# EAGLE design xclock_B (EAGLE 7.7.0)
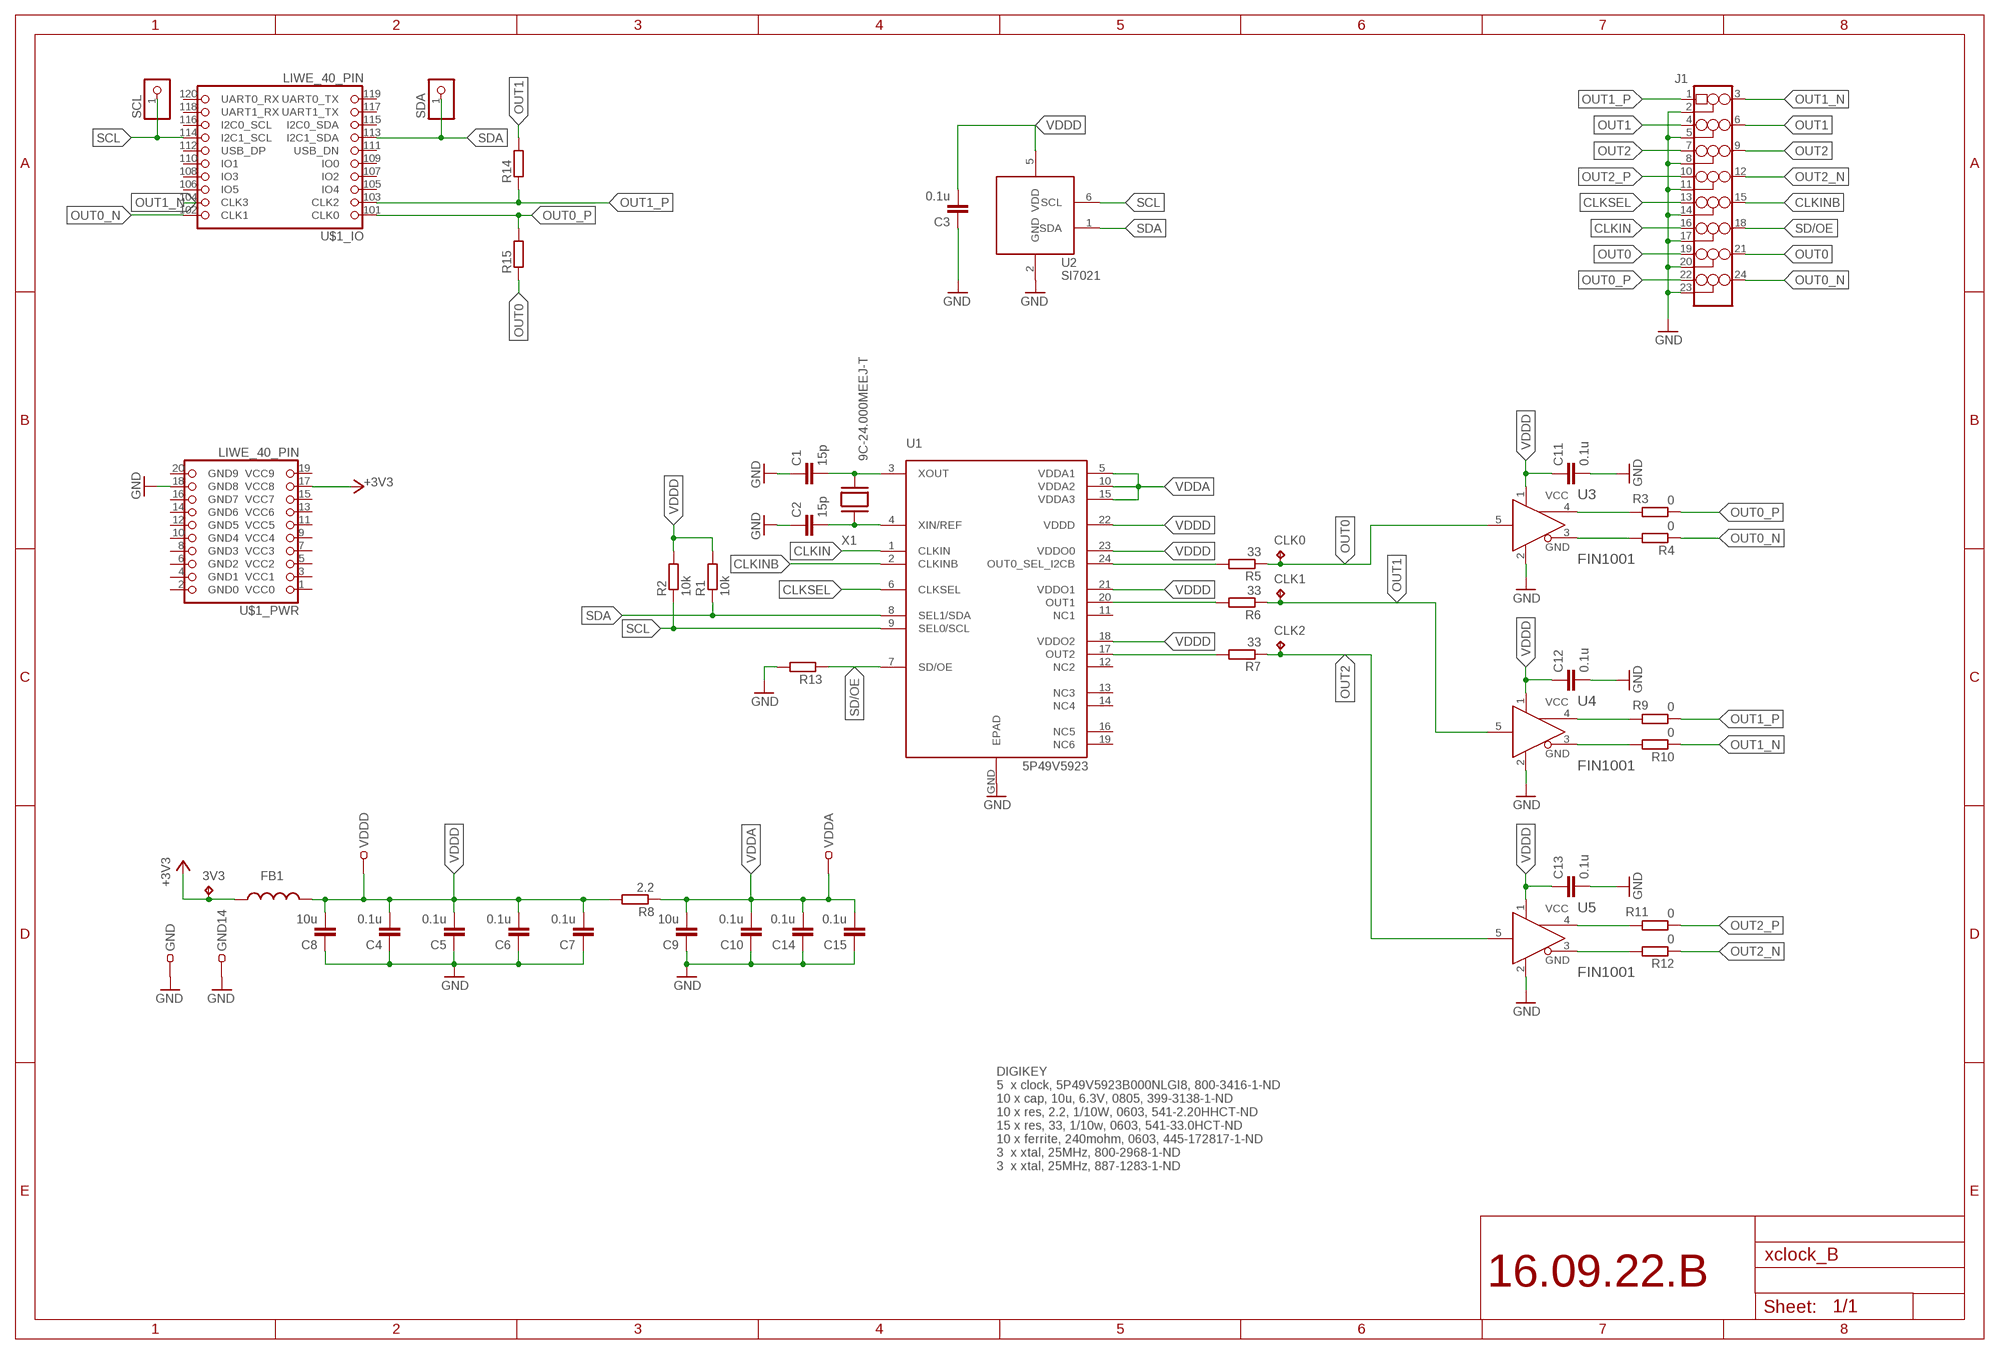
[diagram p0: schematic, sheet 1]

## Parts
3V3  TPB1,27  [B1,27]
C1  15p  C-EUC0603  [C0603]
C2  15p  C-EUC0603  [C0603]
C3  0.1u  C-EUC0603  [C0603]
C4  0.1u  C-EUC0603  [C0603]
C5  0.1u  C-EUC0603  [C0603]
C6  0.1u  C-EUC0603  [C0603]
C7  0.1u  C-EUC0603  [C0603]
C8  10u  C-EUC0805  [C0805]
C9  10u  C-EUC0805  [C0805]
C10  0.1u  C-EUC0603  [C0603]
C11  0.1u  C-EUC0603  [C0603]
C12  0.1u  C-EUC0603  [C0603]
C13  0.1u  C-EUC0603  [C0603]
C14  0.1u  C-EUC0603  [C0603]
C15  0.1u  C-EUC0603  [C0603]
CLK0  TPB1,27  [B1,27]
CLK1  TPB1,27  [B1,27]
CLK2  TPB1,27  [B1,27]
FB1  L0603(1608)  [L0603]
GND  TEST-22-MULTICOMP  [TEST_1MM]
GND14  TEST-22-MULTICOMP  [TEST_1MM]
J1  PINHD-3X8/90  [3X08/90]
R1  10k  R-EU_R0603  [R0603]
R2  10k  R-EU_R0603  [R0603]
R3  0  R-EU_R0603  [R0603]
R4  0  R-EU_R0603  [R0603]
R5  33  R-EU_R0603  [R0603]
R6  33  R-EU_R0603  [R0603]
R7  33  R-EU_R0603  [R0603]
R8  2.2  R-EU_R0603  [R0603]
R9  0  R-EU_R0603  [R0603]
R10  0  R-EU_R0603  [R0603]
R11  0  R-EU_R0603  [R0603]
R12  0  R-EU_R0603  [R0603]
R13  R-EU_R0603  [R0603]
R14  R-EU_R0603  [R0603]
R15  R-EU_R0603  [R0603]
SCL  PINHD-1X1  [1X01]
SDA  PINHD-1X1  [1X01]
U1  5P49V5923  [VFQFPN_24_4X4]
U2  SI7021  [SI7021]
U3  FIN1001  [SOT95P280X140-5N]
U4  FIN1001  [SOT95P280X140-5N]
U5  FIN1001  [SOT95P280X140-5N]
U$1  LIWE_40_PIN  [LIWE_40_PIN_8X8]
VDDA  TEST-22-MULTICOMP  [TEST_1MM]
VDDD  TEST-22-MULTICOMP  [TEST_1MM]
X1  9C-24.000MEEJ-T  TXC_9C  [TXC_SMD_HC-49S]

## Nets
+3V3: 3V3.TP FB1.1 U$1.17(_PWR:VCC8)
CLKIN: J1.16 U1.1(CLKIN)
CLKINB: J1.15 U1.2(CLKINB)
CLKSEL: J1.13 U1.6(CLKSEL)
GND: C1.1 C2.1 C3.1 C4.1 C5.1 C6.1 C7.1 C8.1 C9.1 C10.1 C11.2 C12.2 C13.2 C14.1 C15.1 GND14.1 GND.1 J1.2 J1.5 J1.8 J1.11 J1.14 J1.17 J1.20 J1.23 R13.2 U1.GND(EPAD) U2.2(GND) U3.2(GND) U4.2(GND) U5.2(GND) U$1.18(_PWR:GND8)
OUT0: CLK0.TP J1.19 J1.21 R5.1 R15.1 U3.5(RIN)
OUT0_: R5.2 U1.24(OUT0_SEL_I2CB)
OUT0_N: J1.24 R4.1 U$1.102(_IO:CLK1)
OUT0_N_: R4.2 U3.3(ROUT-)
OUT0_P: J1.22 R3.1 R15.2 U$1.101(_IO:CLK0)
OUT0_P_: R3.2 U3.4(ROUT+)
OUT1: CLK1.TP J1.4 J1.6 R6.1 R14.2 U4.5(RIN)
OUT1_: R6.2 U1.20(OUT1)
OUT1_N: J1.3 R10.1 U$1.104(_IO:CLK3)
OUT1_N_: R10.2 U4.3(ROUT-)
OUT1_P: J1.1 R9.1 R14.1 U$1.103(_IO:CLK2)
OUT1_P_: R9.2 U4.4(ROUT+)
OUT2: CLK2.TP J1.7 J1.9 R7.1 U5.5(RIN)
OUT2_: R7.2 U1.17(OUT2)
OUT2_N: J1.12 R12.1
OUT2_N_: R12.2 U5.3(ROUT-)
OUT2_P: J1.10 R11.1
OUT2_P_: R11.2 U5.4(ROUT+)
SCL: R2.1 SCL.1 U1.9(SEL0/SCL) U2.6(SCL) U$1.114(_IO:I2C1_SCL)
SD/OE: J1.18 R13.1 U1.7(SD/OE)
SDA: R1.1 SDA.1 U1.8(SEL1/SDA) U2.1(SDA) U$1.113(_IO:I2C1_SDA)
VDDA: C9.2 C10.2 C14.2 C15.2 R8.1 U1.5(VDDA1) U1.10(VDDA2) U1.15(VDDA3) VDDA.1
VDDD: C3.2 C4.2 C5.2 C6.2 C7.2 C8.2 C11.1 C12.1 C13.1 FB1.2 R1.2 R2.2 R8.2 U1.18(VDDO2) U1.21(VDDO1) U1.22(VDDD) U1.23(VDDO0) U2.5(VDD) U3.1(VCC) U4.1(VCC) U5.1(VCC) VDDD.1
XIN: C2.2 U1.4(XIN/REF) X1.1
XOUT: C1.2 U1.3(XOUT) X1.2
Unconnected: U1.11(NC1) U1.12(NC2) U1.13(NC3) U1.14(NC4) U1.16(NC5) U1.19(NC6) U$1.1(_PWR:VCC0) U$1.2(_PWR:GND0) U$1.3(_PWR:VCC1) U$1.4(_PWR:GND1) U$1.5(_PWR:VCC2) U$1.6(_PWR:GND2) U$1.7(_PWR:VCC3) U$1.8(_PWR:GND3) U$1.9(_PWR:VCC4) U$1.10(_PWR:GND4) U$1.11(_PWR:VCC5) U$1.12(_PWR:GND5) U$1.13(_PWR:VCC6) U$1.14(_PWR:GND6) U$1.15(_PWR:VCC7) U$1.16(_PWR:GND7) U$1.19(_PWR:VCC9) U$1.20(_PWR:GND9) U$1.105(_IO:IO4) U$1.106(_IO:IO5) U$1.107(_IO:IO2) U$1.108(_IO:IO3) U$1.109(_IO:IO0) U$1.110(_IO:IO1) U$1.111(_IO:USB_DN) U$1.112(_IO:USB_DP) U$1.115(_IO:I2C0_SDA) U$1.116(_IO:I2C0_SCL) U$1.117(_IO:UART1_TX) U$1.118(_IO:UART1_RX) U$1.119(_IO:UART0_TX) U$1.120(_IO:UART0_RX)

## Notes on the sheet
- DIGIKEY
  5  x clock, 5P49V5923B000NLGI8, 800-3416-1-ND
  10 x cap, 10u, 6.3V, 0805, 399-3138-1-ND
  10 x res, 2.2, 1/10W, 0603, 541-2.20HHCT-ND
  15 x res, 33, 1/10w, 0603, 541-33.0HCT-ND
  10 x ferrite, 240mohm, 0603, 445-172817-1-ND
  3  x xtal, 25MHz, 800-2968-1-ND
  3  x xtal, 25MHz, 887-1283-1-ND
- 16.09.22.B

## Library data of the parts
3V3 CLK0 CLK1 CLK2 = testpad:TP: Test pad
C1-C15 = rcl:C-EU: CAPACITOR, European symbol
FB1 = 25cmsquare:L
GND GND14 VDDA VDDD = 25cmsquare:TEST-22-MULTICOMP: MULTICOMP TEST-22 TEST PIN, PCB, 1.0MM FARNELL: 1702010
J1 = 25pinhead:PINHD-3X8
R1-R15 = rcl:R-EU_: RESISTOR, European symbol
SCL SDA = 25pinhead:PINHD-1X1: PIN HEADER
U1 = 25cmsquare:5P49V5923
U2 = 25cmsquare:SI7021: SI7021 https://www.silabs.com/Support%20Documents/TechnicalDocs/Si7021-A20.pdf
U3-U5 = 25cmsquare:FIN1001
U$1 = 25cmsquare:LIWE_40_PIN
X1 = 25cmsquare:TXC_9C

## Board
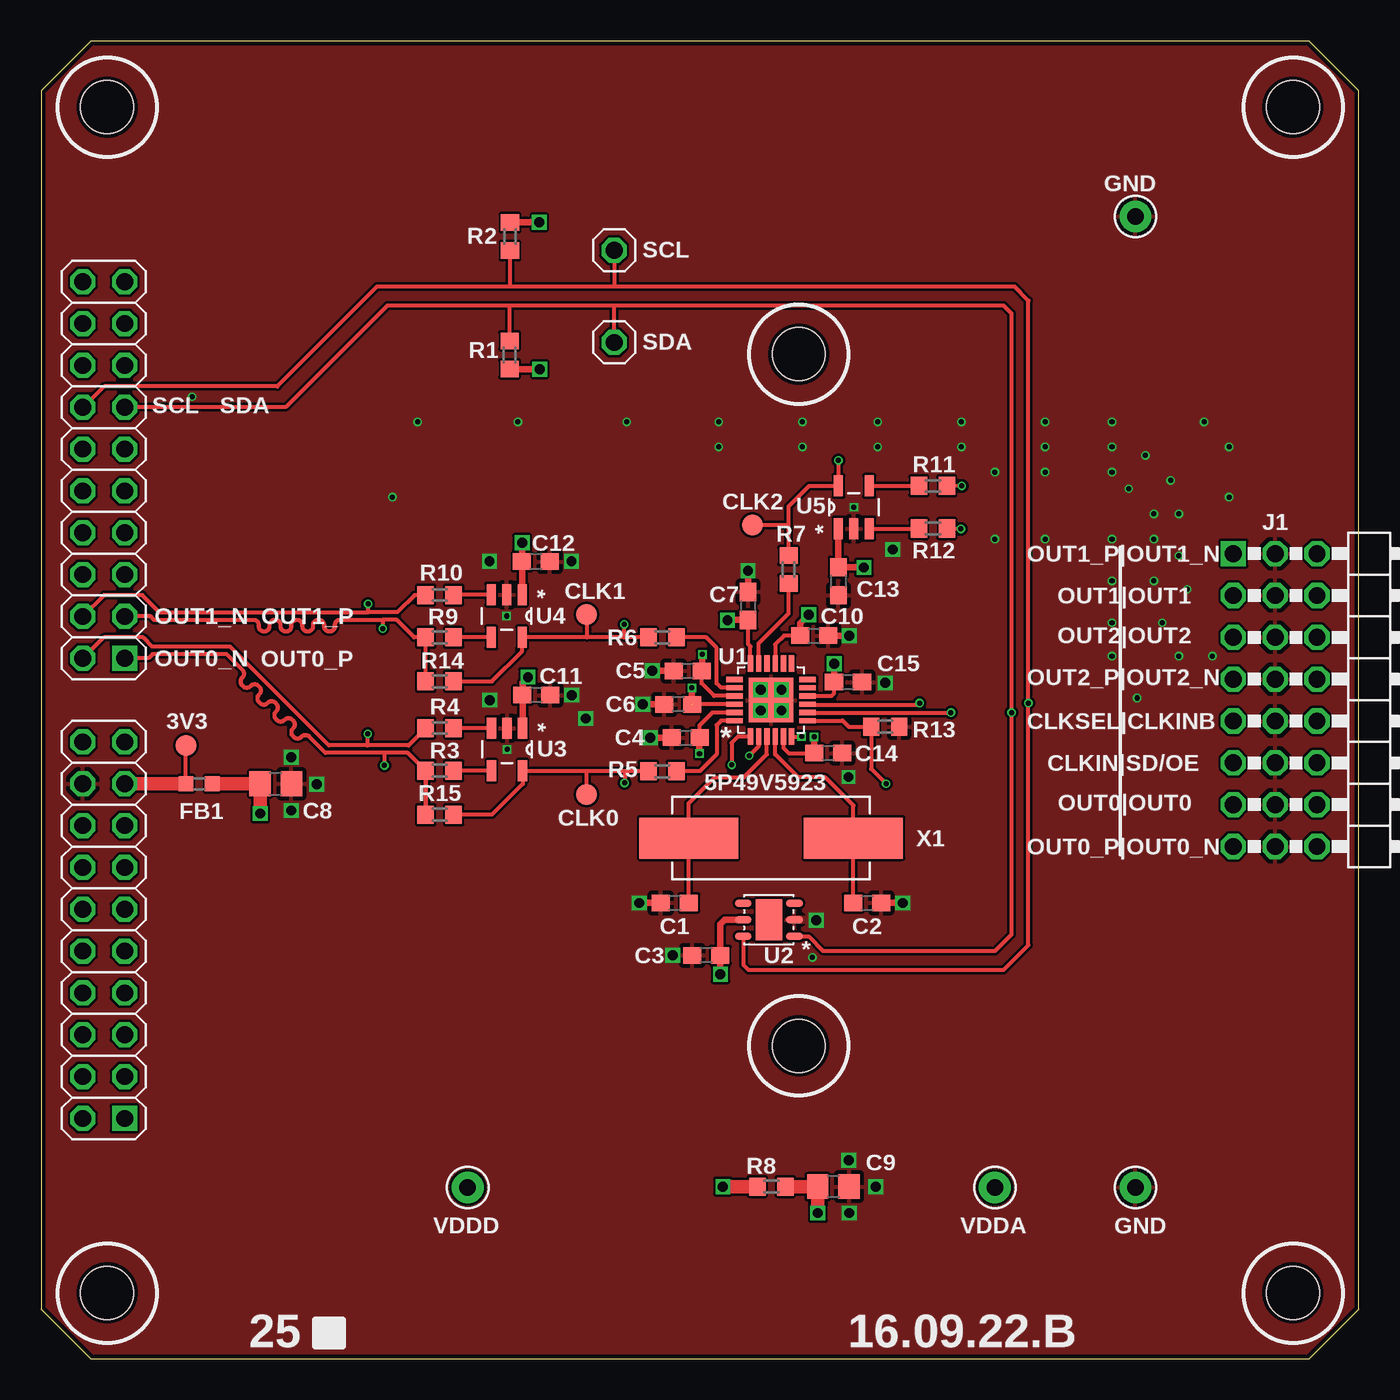
[diagram p1: board, top side]
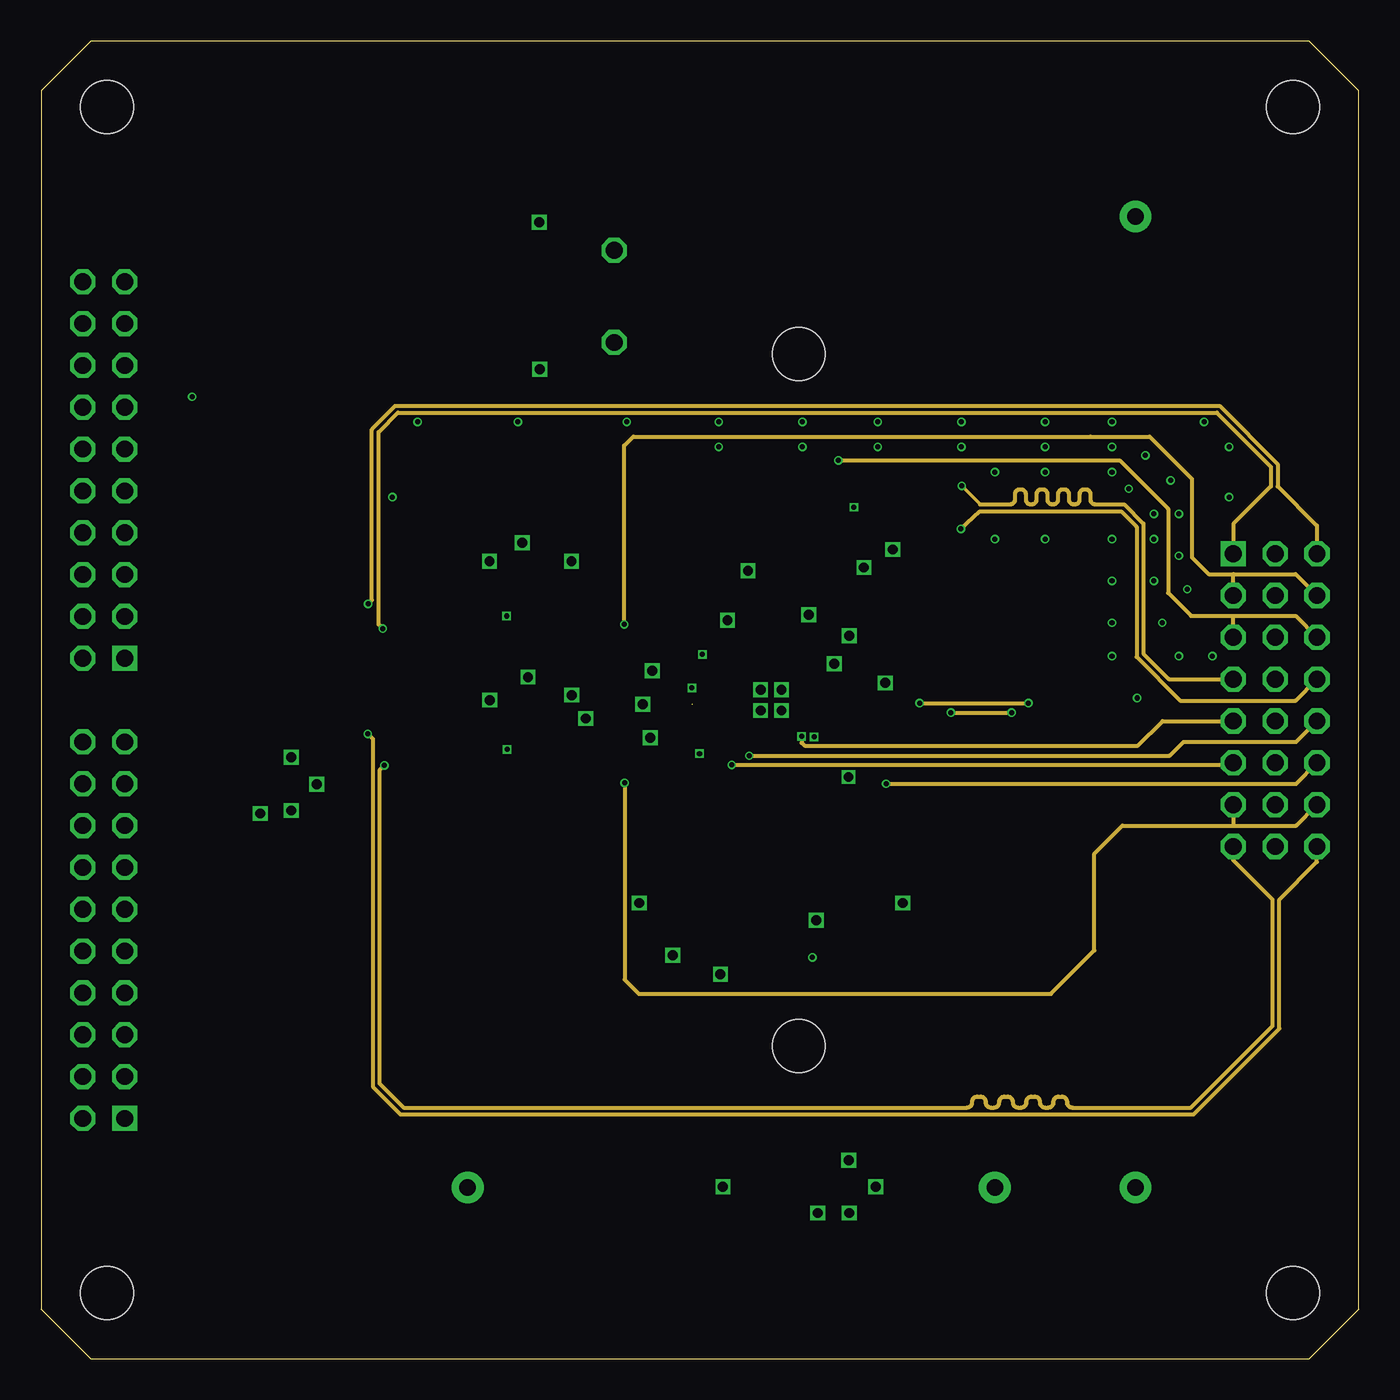
[diagram p2: board, inner layer Route2]
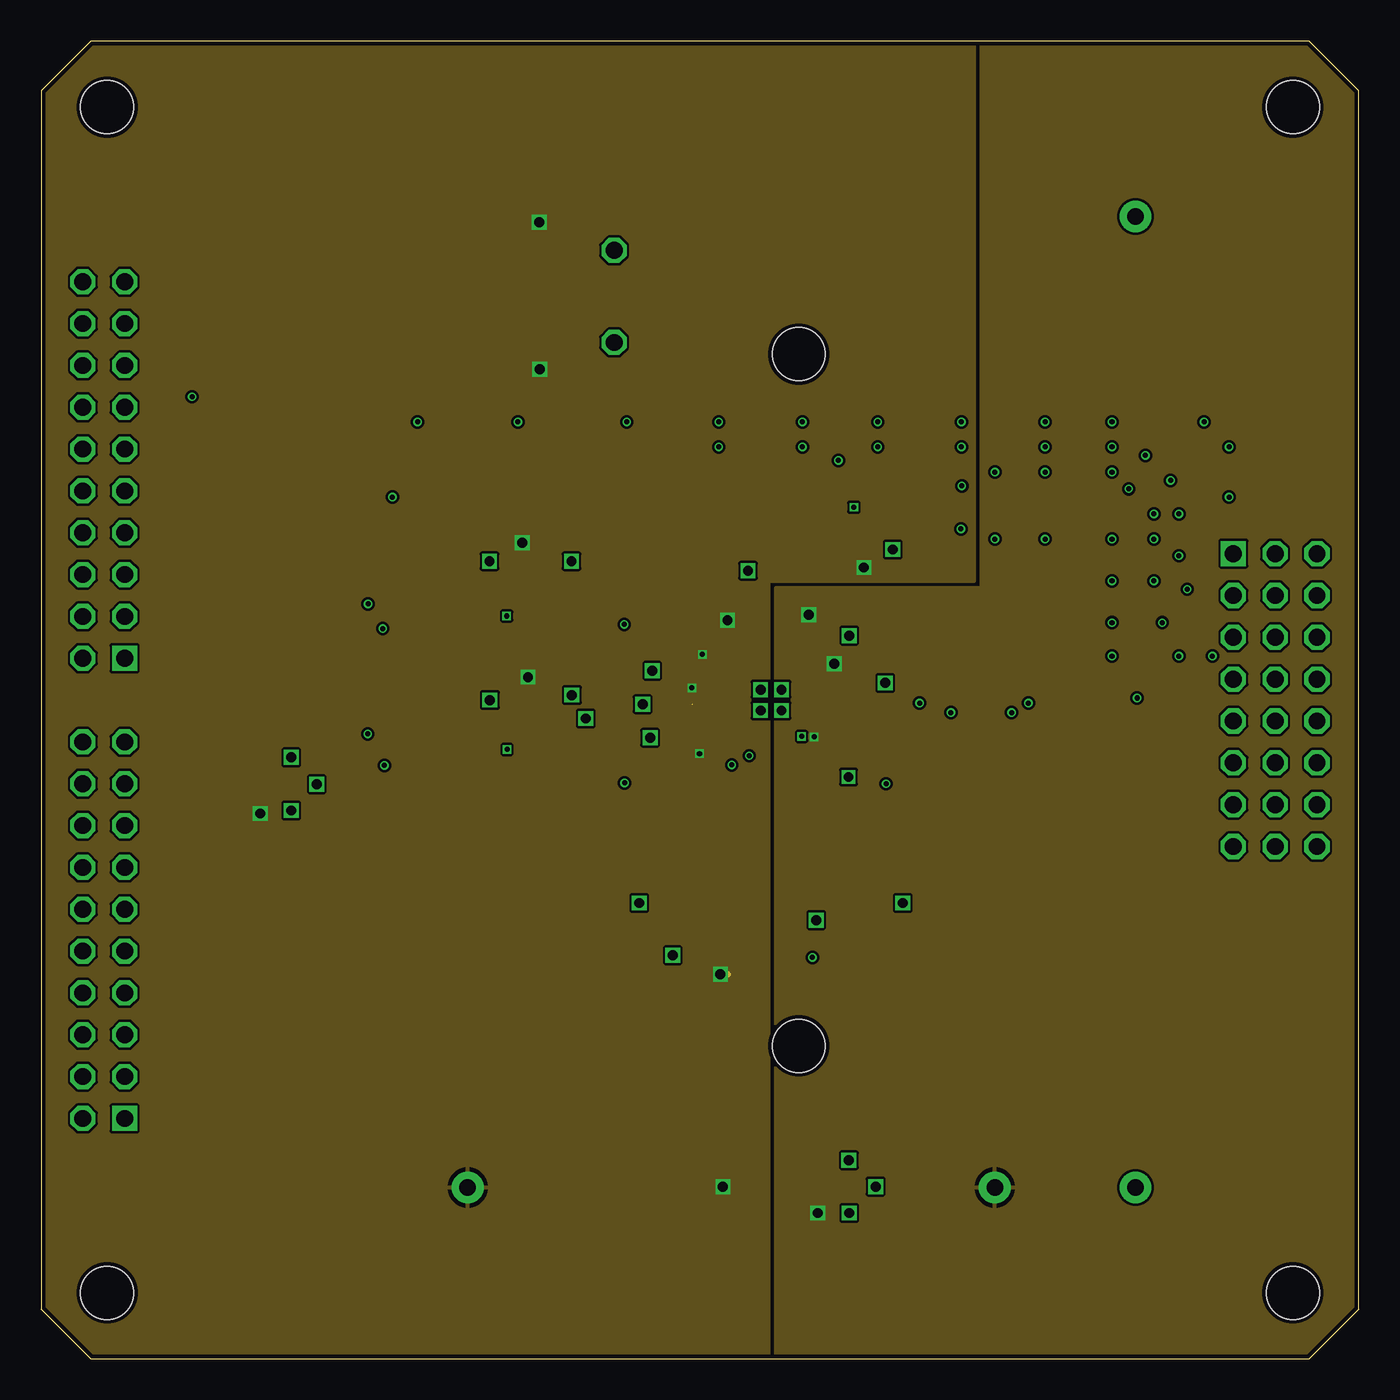
[diagram p3: board, inner layer Route15]
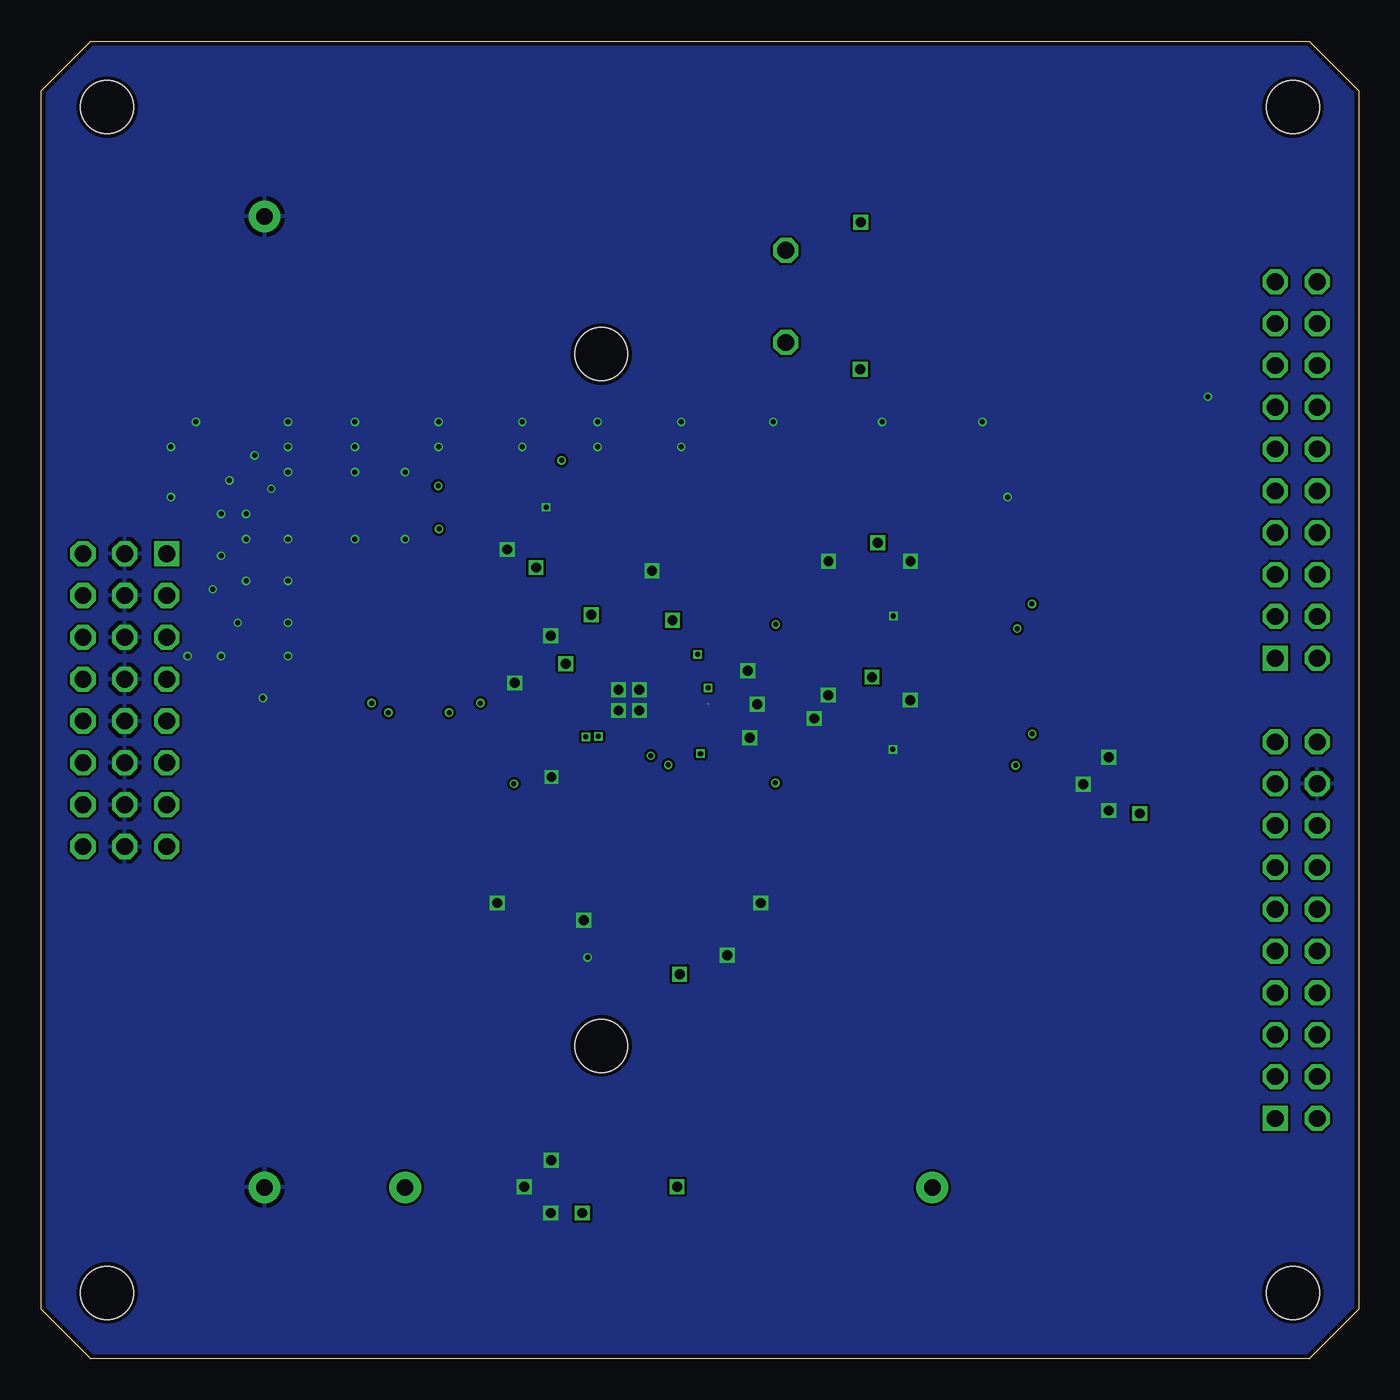
[diagram p4: board, bottom side, seen from below]

Size 80 x 80 mm. Coordinates in mm from the lower left corner, seen from the top.
Copper layers (1*2*15*16): Top 0.035mm / dielectric 0.2mm / Route2 0.0175mm / dielectric 0.3mm / Route15 0.0175mm / dielectric 0.2mm / Bottom 0.035mm
Design rules "SeeedStudio_4layer_DRU_no_angle_20140221_6 *": minimum track width 8mil, minimum drill 12mil, track to track 6mil, track to pad 6mil, pad to pad 6mil, via to via 6mil, smd to smd 0mil, copper to edge 10mil, drill to drill 8mil, minimum pad ring 6mil, minimum via ring 4mil, stop-mask expansion 2mil, vias tented up to drill 25mil, thermal gap 10mil

### Footprints (pad centres in the part's own frame; a part is rotated, then mirrored left to right if it is on the bottom)
B1,27 = smd 1.27 x 1.27: TP 0,0
C0603 = smd 1.1 x 1: 1 -0.85,0; 2 0.85,0
C0805 = smd 1.3 x 1.5: 1 -0.95,0; 2 0.95,0
L0603 = smd 0.9 x 0.9: 1 -0.8,0; 2 0.8,0
TEST_1MM = drill 1 pad 1.93: 1 0,0
3X08/90 = drill 1.016 square: 1 0,0 | drill 1.016 octagon: 2 0,2.54; 3 0,5.08; 4 2.54,0; 5 2.54,2.54; 6 2.54,5.08; 7 5.08,0; 8 5.08,2.54; 9 5.08,5.08; 10 7.62,0; 11 7.62,2.54; 12 7.62,5.08; 13 10.16,0; 14 10.16,2.54; 15 10.16,5.08; 16 12.7,0; 17 12.7,2.54; 18 12.7,5.08; 19 15.24,0; 20 15.24,2.54; 21 15.24,5.08; 22 17.78,0; 23 17.78,2.54; 24 17.78,5.08
R0603 = smd 1 x 1.1: 1 -0.85,0; 2 0.85,0
1X01 = drill 1.016 octagon: 1 0,0
VFQFPN_24_4X4 = smd 0.32 x 1: 1 -1.25,-2.215; 2 -0.75,-2.215; 3 -0.25,-2.215; 4 0.25,-2.215; 5 0.75,-2.215; 6 1.25,-2.215; 13 1.25,2.215; 14 0.75,2.215; 15 0.25,2.215; 16 -0.25,2.215; 17 -0.75,2.215; 18 -1.25,2.215 | smd 1 x 0.32: 7 2.215,-1.25; 8 2.215,-0.75; 9 2.215,-0.25; 10 2.215,0.25; 11 2.215,0.75; 12 2.215,1.25; 19 -2.215,1.25; 20 -2.215,0.75; 21 -2.215,0.25; 22 -2.215,-0.25; 23 -2.215,-0.75; 24 -2.215,-1.25 | smd 2.7 x 2.7: GND 0,0
SI7021 = smd 1 x 0.45: 1 -1.55,1; 2 -1.55,0; 3 -1.55,-1; 4 1.55,-1; 5 1.55,0; 6 1.55,1 | smd 1.6 x 2.5: P$7 0,0
SOT95P280X140-5N = smd 1.27 x 0.559: 1 -1.295,0.94; 2 -1.295,0; 3 -1.295,-0.94; 4 1.295,-0.94; 5 1.295,0.94
LIWE_40_PIN_8X8 = drill 1.016 square: 1 74.93,65.405; 101 74.93,37.465 | drill 1.016 octagon: 2 77.47,65.405; 3 74.93,62.865; 4 77.47,62.865; 5 74.93,60.325; 6 77.47,60.325; 7 74.93,57.785; 8 77.47,57.785; 9 74.93,55.245; 10 77.47,55.245; 11 74.93,52.705; 12 77.47,52.705; 13 74.93,50.165; 14 77.47,50.165; 15 74.93,47.625; 16 77.47,47.625; 17 74.93,45.085; 18 77.47,45.085; 19 74.93,42.545; 20 77.47,42.545; 102 77.47,37.465; 103 74.93,34.925; 104 77.47,34.925; 105 74.93,32.385; 106 77.47,32.385; 107 74.93,29.845; 108 77.47,29.845; 109 74.93,27.305; 110 77.47,27.305; 111 74.93,24.765; 112 77.47,24.765; 113 74.93,22.225; 114 77.47,22.225; 115 74.93,19.685; 116 77.47,19.685; 117 74.93,17.145; 118 77.47,17.145; 119 74.93,14.605; 120 77.47,14.605 | hole 3.2: 34,19; 34,61; 4,76; 4,4; 76,4; 76,76
TXC_SMD_HC-49S = smd 6 x 2.5: 1 -5,0; 2 5,0

### Placement (x,y rotation side)
3V3  8.78,37.23 180 top
C1  38.47,27.68 0 top
C2  50.15,27.68 180 top
C3  40.38,24.5 0 top
C4  39.13,37.71 0 top
C5  39.26,41.77 0 top
C6  38.67,39.74 0 top
C7  42.92,45.71 270 top
C8  14.24,34.91 180 top
C9  48.1,10.45 180 top
C10  46.93,43.91 180 top
C11  30.06,40.3 0 top
C12  30.04,48.4 0 top
C13  48.4,47.21 270 top
C14  47.79,36.77 180 top
C15  48.99,41.09 180 top
CLK0  33.11,34.25 180 top
CLK1  33.11,45.18 180 top
CLK2  43.2,50.64 180 top
FB1  9.59,34.91 0 top
GND  66.44,69.36 180 top
GND14  66.44,10.4 0 top
J1  72.38,48.88 270 top
R1  28.44,60.95 270 top
R2  28.46,68.14 90 top
R3  24.2,35.7 0 top
R4  24.2,38.29 0 top
R5  37.71,35.68 0 top
R6  37.71,43.8 0 top
R7  45.38,47.92 270 top
R8  44.34,10.45 180 top
R9  24.2,43.8 0 top
R10  24.2,46.37 0 top
R11  54.14,53 180 top
R12  54.14,50.41 180 top
R13  51.25,38.37 0 top
R14  24.2,41.14 0 top
R15  24.2,33.04 180 top
SCL  34.79,67.3 0 top
SDA  34.79,61.71 0 top
U1  44.31,39.99 0 top
U2  44.19,26.66 180 top
U3  28.29,37 270 top
U4  28.26,45.1 270 top
U5  49.34,51.7 90 top
U$1  80,80 180 top
VDDA  57.9,10.4 0 top
VDDD  25.9,10.4 0 top
X1  44.31,31.61 180 top

### Tracks (layer width: path | path; a pad name or v marks a point on that pad's centre or on a via)
+3V3
  Top 0.254: FB1.1 8.78,34.93 3V3.TP
  Top 0.813: U$1.17 FB1.1
CLKIN  (via drill 0.3)
  Top 0.254: U1.1 42.3,37.78 41.92,37.4 v41.92,36.06
  Route2 0.254: v41.92,36.06 72.25,36.06 J1.16
CLKINB  (via drill 0.3)
  Top 0.254: U1.2 43.56,37.19 v42.99,36.62
  Route2 0.254: v42.99,36.62 68.52,36.62 69.36,37.45 76.19,37.45 J1.15
CLKSEL  (via drill 0.3)
  Top 0.254: U1.6 v46.16,37.78 v46.17,37.78
  Route2 0.254: v46.17,37.78 46.17,37.4 46.34,37.23 66.59,37.23 68.09,38.72 J1.13
GND  (via drill 0.3, 0.56, 0.6)
  Top 0.254: 45.46,39.23 45.13,39.45 | 45.13,39.45 U1.GND | v44.95,39.36 45.05,39.36 45.13,39.45
  Top 0.406: C10.1 v49.06,43.91 | v36.97,37.71 C4.1 | v36.51,39.74 C6.1 | v37.1,41.77 C5.1 | C7.1 v42.92,47.84 | C2.1 v52.31,27.68 | C1.1 v36.31,27.68
  other vias: 43.68,39.36 43.68,40.63 44.95,40.63 50.66,10.45 38.34,24.5 27.22,48.43 51.7,49.14 51.25,41.04 33.06,38.88 27.24,39.99 49.01,35.32 47.06,26.63 32.22,40.3 32.2,48.43 16.73,34.89 15.18,36.52 15.18,33.29 28.26,45.1 28.29,37 49.04,12.05 49.06,8.85 49.34,51.7 9.16,58.41 46.83,24.37 22.85,56.89 21.33,52.31 28.95,56.89 35.55,56.89 41.14,56.89 46.22,56.89 50.79,56.89 55.87,56.89 60.95,56.89 65.01,56.89 70.6,56.89 72.13,55.36 72.13,52.31 46.22,55.36 50.79,55.36 55.87,55.36 60.95,55.36 65.01,55.36 67.05,54.85 68.57,53.33 69.08,51.3 69.08,48.76 69.59,46.73 60.95,53.84 57.9,53.84 65.01,53.84 66.03,52.82 67.55,51.3 67.55,49.77 67.55,47.23 68.06,44.69 69.08,42.66 71.11,42.66 57.9,49.77 60.95,49.77 65.01,49.77 65.01,47.23 65.01,44.69 65.01,42.66 66.54,40.12 41.14,55.36
  pour Bottom: -2.04,81.27 -2.04,-2.55 81.65,-2.55 81.65,81.27
  pour Top: -3.69,83.43 -3.69,-4.96 83.56,-4.96 83.56,83.43
  pour Top (no thermals): 45.58,26.53 46.6,26.53 46.6,26.79 45.58,26.79
OUT0  (via drill 0.3)
  Top 0.254: 35.42,35.68 33.14,35.68 | 33.14,35.68 29.25,35.68 | 29.25,35.68 U3.5 | CLK0.TP 33.11,35.65 33.14,35.68 | 29.25,35.68 29.25,34.91 27.37,33.03 R15.1 | R5.1 35.42,35.68 | 35.42,35.68 v35.42,34.97
  Route2 0.254: v35.42,34.97 35.42,23.03 36.29,22.16 61.31,22.16 63.95,24.81 63.95,30.67 65.65,32.37 72.38,32.37 | 72.38,32.37 76.19,32.37 J1.21 | J1.19 72.38,32.37
OUT0_
  Top 0.254: U1.24 41.28,38.74 41.01,38.47 41.01,36.69 39.99,35.68 R5.2
OUT0_N  (via drill 0.3)
  Top 0.254: U$1.102 3.8,43.8 6.19,43.8 6.75,43.25 11.48,43.25 17.47,37.25 19.83,37.25 | R4.1 22.3,37.25 19.83,37.25 | 19.83,37.25 v19.83,37.94
  Route2 0.254: v19.83,37.94 20.13,37.63 20.13,16.53 21.81,14.85 69.97,14.85 75.17,20.05 75.17,27.88 77.46,30.16 J1.24
OUT0_N_
  Top 0.254: U3.3 R4.2
OUT0_P  (via drill 0.3)
  Top 0.254: 20.84,36.79 17.25,36.79 16.27,37.78 arc90 15.82,37.78 15.79,37.75 arc-90 15.34,37.75 15.28,37.82 arc-90 15.28,38.27 15.3,38.29 arc90 15.3,38.74 15.24,38.81 arc90 14.79,38.81 14.76,38.78 arc-90 14.31,38.78 14.25,38.85 arc-90 14.25,39.29 14.28,39.32 arc90 14.28,39.77 14.21,39.84 arc90 13.76,39.84 13.74,39.81 arc-90 13.29,39.81 13.22,39.87 arc-90 13.22,40.32 13.25,40.35 arc90 13.25,40.8 13.18,40.86 arc90 12.74,40.86 12.71,40.84 arc-90 12.26,40.84 12.19,40.9 arc-90 12.19,41.35 12.22,41.38 arc90 12.22,41.83 11.26,42.79 6.77,42.79 6.52,42.53 U$1.101 | 23.38,35.65 23.38,35.57 23.35,35.54 R15.2 R3.1 22.25,36.79 20.84,36.79 | 20.84,36.79 v20.84,36.03
  Route2 0.254: v20.84,36.03 20.54,35.73 20.54,16.73 22.01,15.25 56.2,15.25 arc90 56.52,15.57 56.52,15.6 arc-90 56.84,15.92 57.03,15.92 arc-90 57.34,15.6 57.34,15.57 arc90 57.66,15.25 57.85,15.25 arc90 58.17,15.57 58.17,15.6 arc-90 58.49,15.92 58.67,15.92 arc-90 58.99,15.6 58.99,15.57 arc90 59.31,15.25 59.5,15.25 arc90 59.81,15.57 59.81,15.6 arc-90 60.13,15.92 60.32,15.92 arc-90 60.64,15.6 60.64,15.57 arc90 60.95,15.25 61.14,15.25 arc90 61.46,15.57 61.46,15.6 arc-90 61.78,15.92 61.97,15.92 arc-90 62.28,15.6 62.28,15.57 arc90 62.6,15.25 69.81,15.25 74.77,20.22 74.77,27.88 72.38,30.27 J1.22
OUT0_P_
  Top 0.254: U3.4 R3.2
OUT1  (via drill 0.3)
  Top 0.254: 35.4,43.8 33.14,43.8 | 33.14,43.8 U4.5 29.2,42.97 27.37,41.14 R14.2 | CLK1.TP 33.11,43.83 33.14,43.8 | R6.1 35.4,43.8 | 35.4,43.8 v35.4,44.59
  Route2 0.254: v35.4,44.59 35.4,55.44 35.96,56 63.72,56 67.3,56 69.86,53.43 69.86,48.66 70.88,47.64 72.38,47.64 | 72.38,47.64 76.16,47.64 J1.6 | J1.4 72.38,47.64
OUT1_
  Top 0.254: U1.20 41.28,40.74 41.01,41.01 41.01,43.17 40.38,43.8 R6.2
OUT1_N  (via drill 0.3)
  Top 0.254: U$1.104 3.82,46.37 6.14,46.37 7.18,45.33 19.85,45.33 | R10.1 22.67,46.37 21.63,45.33 19.85,45.33 | 19.85,45.33 v19.85,45.84
  Route2 0.254: v19.85,45.84 20.08,46.07 20.08,56.44 21.5,57.85 71.55,57.85 75.07,54.33 75.07,52.97 77.46,50.59 J1.3
OUT1_N_
  Top 0.254: U4.3 25.07,46.4 R10.2
OUT1_P  (via drill 0.3)
  Top 0.203: R14.1 R9.1
  Top 0.254: R9.1 22.65,43.8 21.58,44.87 20.74,44.87 | 20.74,44.87 18.15,44.87 arc90 17.83,44.55 17.83,44.48 arc-90 17.52,44.17 17.49,44.17 arc-90 17.17,44.48 17.17,44.55 arc90 16.85,44.87 16.83,44.87 arc90 16.51,44.55 16.51,44.48 arc-90 16.19,44.17 16.17,44.17 arc-90 15.85,44.48 15.85,44.55 arc90 15.53,44.87 15.51,44.87 arc90 15.19,44.55 15.19,44.48 arc-90 14.87,44.17 14.85,44.17 arc-90 14.53,44.48 14.53,44.55 arc90 14.21,44.87 14.18,44.87 arc90 13.87,44.55 13.87,44.48 arc-90 13.55,44.17 13.52,44.17 arc-90 13.21,44.48 13.21,44.55 arc90 12.89,44.87 6.85,44.87 6.64,45.07 U$1.103 | R14.1 R9.1 | R9.1 | 20.74,44.87 v20.74,44.34
  Route2 0.254: v20.74,44.34 20.49,44.59 20.49,56.27 21.66,57.44 71.38,57.44 74.67,54.16 74.67,52.97 72.38,50.69 J1.1
OUT1_P_
  Top 0.254: U4.4 R9.2
OUT2  (via drill 0.3)
  Top 0.254: R7.1 45.38,50.64 | 45.38,50.64 45.38,51.75 46.62,53 U5.5 v48.4,54.55 | CLK2.TP 45.38,50.64
  Route2 0.254: v48.4,54.55 65.22,54.55 65.47,54.55 68.42,51.6 68.42,46.5 69.81,45.1 72.38,45.1 | 72.38,45.1 76.16,45.1 J1.9 | J1.7 72.38,45.1
OUT2_
  Top 0.254: U1.17 43.56,43.44 45.38,45.25 R7.2
OUT2_N  (via drill 0.3)
  Top 0.203: R12.1 55.02,50.38 v55.84,50.38
  Route2 0.254: v55.84,50.38 56.99,51.45 65.57,51.45 66.51,50.51 66.51,42.61 69.16,39.97 76.16,39.97 J1.12
OUT2_N_
  Top 0.254: U5.3 R12.2
OUT2_P  (via drill 0.3)
  Top 0.203: R11.1 v55.89,53
  Route2 0.203: v55.89,53 57.01,51.88
  Route2 0.254: 57.01,51.88 58.83,51.88 arc90 59.13,52.17 59.13,52.5 arc-90 59.42,52.79 59.49,52.79 arc-90 59.78,52.5 59.78,52.17 arc90 60.07,51.88 60.14,51.88 arc90 60.43,52.17 60.43,52.5 arc-90 60.73,52.79 60.8,52.79 arc-90 61.09,52.5 61.09,52.17 arc90 61.38,51.88 61.45,51.88 arc90 61.74,52.17 61.74,52.5 arc-90 62.03,52.79 62.1,52.79 arc-90 62.4,52.5 62.4,52.17 arc90 62.69,51.88 62.76,51.88 arc90 63.05,52.17 63.05,52.5 arc-90 63.34,52.79 63.41,52.79 arc-90 63.71,52.5 63.71,52.17 arc90 64,51.88 65.75,51.88 66.92,50.71 66.92,42.81 68.47,41.26 J1.10
OUT2_P_
  Top 0.254: U5.4 R11.2
SCL  (via drill 0.3)
  Top 0.254: 42.64,23.92 42.63,23.92 U2.6 42.64,23.92 | U1.9 46.56,39.72 53.23,39.72 v53.33,39.82 | 34.79,65.09 59.1,65.09 59.93,64.25 v59.93,39.82 59.93,25.11 58.43,23.61 42.94,23.61 42.64,23.92 | 34.79,65.09 28.44,65.09 | 28.44,65.09 20.39,65.09 14.34,59.04 3.82,59.04 2.55,57.77 U$1.114 | R2.1 28.46,65.12 28.44,65.09 | SCL.1 34.79,65.09
  Route2 0.254: v53.33,39.82 v59.93,39.82
SD/OE  (via drill 0.3)
  Top 0.254: U1.7 48.66,38.74 49.04,38.37 R13.1 50.4,35.82 v51.3,34.91
  Route2 0.254: v51.3,34.91 76.19,34.91 J1.18
SDA  (via drill 0.3)
  Top 0.254: U2.1 45.65,25.64 46.6,25.64 47.49,24.75 57.9,24.75 58.92,25.77 v58.92,39.23 58.92,63.46 58.43,63.95 34.79,63.95 | U1.8 46.54,39.23 v55.23,39.23 | 34.79,63.95 28.44,63.95 | 28.44,63.95 21.02,63.95 14.85,57.77 U$1.113 | R1.1 28.44,63.95 | SDA.1 34.79,63.95
  Route2 0.254: v55.23,39.23 v58.92,39.23
VDDA  (via drill 0.3, 0.6)
  Top 0.254: C10.2 45.1,43.91 44.57,43.37 U1.15 | U1.5 45.06,37.09 45.38,36.77 C14.2 | 48.15,41.07 48.15,40.4 47.99,40.24 U1.10 | 48.15,41.07 C15.2 | 48.15,41.07 48.15,41.37
  Top 0.406: C10.2 46.08,44.66 v46.6,45.18 | C14.2 46.94,37.75 v46.93,37.76 | 48.15,41.37 v48.15,42.2
  Top 0.813: C9.2 R8.1 C9.2 v47.16,8.85
  pour Route15: 44.59,46.8 44.59,-0.8 82.74,-0.8 82.74,82.18 57.06,82.18 57.06,46.8
VDDD  (via drill 0.3, 0.6)  (1 unrouted)
  Top 0.203: U1.23 42.09,39.23 | C5.2 40.15,41.81 | U1.22 42.08,39.77 | C4.2
  Top 0.254: U1.21 40.86,40.24 40.1,41.01 40.1,41.76 C5.2 40.12,41.76 | U1.22 C6.2 | 42.09,39.23 40.76,39.23 39.97,38.45 39.97,37.72 C4.2 | U1.18 43.06,43.25 42.92,43.4 C7.2 | 40.45,41.77 40.4,41.77 40.36,41.81 40.15,41.81
  Top 0.406: U3.1 29.22,40.29 C11.1 29.25,40.34 29.25,41.09 v29.56,41.39 | C12.1 U4.1 v29.2,49.54 | 40.15,41.81 v40.15,42.76 | 39.51,39.77 v39.51,40.73 | C4.2 v39.97,36.74 | C7.2 41.68,44.86 v41.67,44.85 | v41.24,23.36 41.23,23.37 C3.2 41.23,26.39 41.49,26.66 U2.5 | U5.1 C13.1 v49.94,48.06 v49.95,48.05 | R2.2 28.49,69 v30.24,69 | R1.2 28.46,60.07 28.46,60.09 v30.27,60.09
  Top 0.813: FB1.2 C8.2 v13.3,33.11 | R8.2 v41.39,10.45
  Route15 0.406: v41.24,23.36 41.7,23.36
  pour Route15: -1.79,81.52 44.19,81.52 56.61,81.55 56.66,81.55 56.66,47.21 44.19,47.21 44.19,-1.53 -2.3,-1.53 -2.3,67.81
XIN
  Top 0.254: X1.1 49.31,33.6 47.61,35.3 45.96,35.3 44.57,36.69 U1.4 | 49.27,31.57 X1.1 | C2.2 49.31,27.68 X1.1
XOUT
  Top 0.254: X1.2 39.31,33.72 40.88,35.3 42.66,35.3 44.06,36.69 U1.3 | 39.36,31.57 X1.2 | C1.2 X1.2

### Text on the board
tNames: SCL | SDA | OUT1_P|OUT1_N | OUT1|OUT1 | OUT1_N | OUT1_P | OUT2|OUT2 | OUT0_N | OUT0_P | OUT2_P|OUT2_N | 3V3 | CLKSEL|CLKINB | CLKIN|SD/OE | 5P49V5923 | OUT0|OUT0 | OUT0_P|OUT0_N | GND | 25 | 16.09.22.B